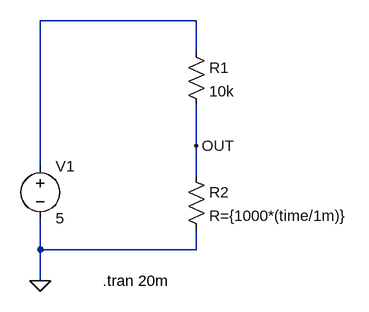
[diagram p0: schematic TimeDependentResistor2.asc]
TimeDependentResistor2.asc, the LTspice schematic file:
Version 4.1
SHEET 1 880 680
WIRE 192 -16 -48 -16
WIRE 192 32 192 -16
WIRE 192 176 192 112
WIRE -48 208 -48 -16
WIRE 192 224 192 176
WIRE -48 336 -48 288
WIRE 192 336 192 304
WIRE 192 336 -48 336
WIRE -48 384 -48 336
FLAG -48 384 0
FLAG 192 176 OUT
SYMBOL voltage -48 192 R0
WINDOW 123 0 0 Left 0
WINDOW 39 0 0 Left 0
SYMATTR InstName V1
SYMATTR Value 5
SYMBOL res 176 16 R0
SYMATTR InstName R1
SYMATTR Value 10k
SYMBOL res 176 208 R0
SYMATTR InstName R2
SYMATTR Value R={1000*(time/1m)}
TEXT 48 384 Left 2 !.tran 20m

The netlist it stands for:
* TimeDependentResistor2.asc
V1 N001 0 5
R1 N001 OUT 10k
R2 OUT 0 R={1000*(time/1m)}
.tran 20m
.backanno
.end